# EAGLE design BrewDoo (EAGLE 7.2.0)
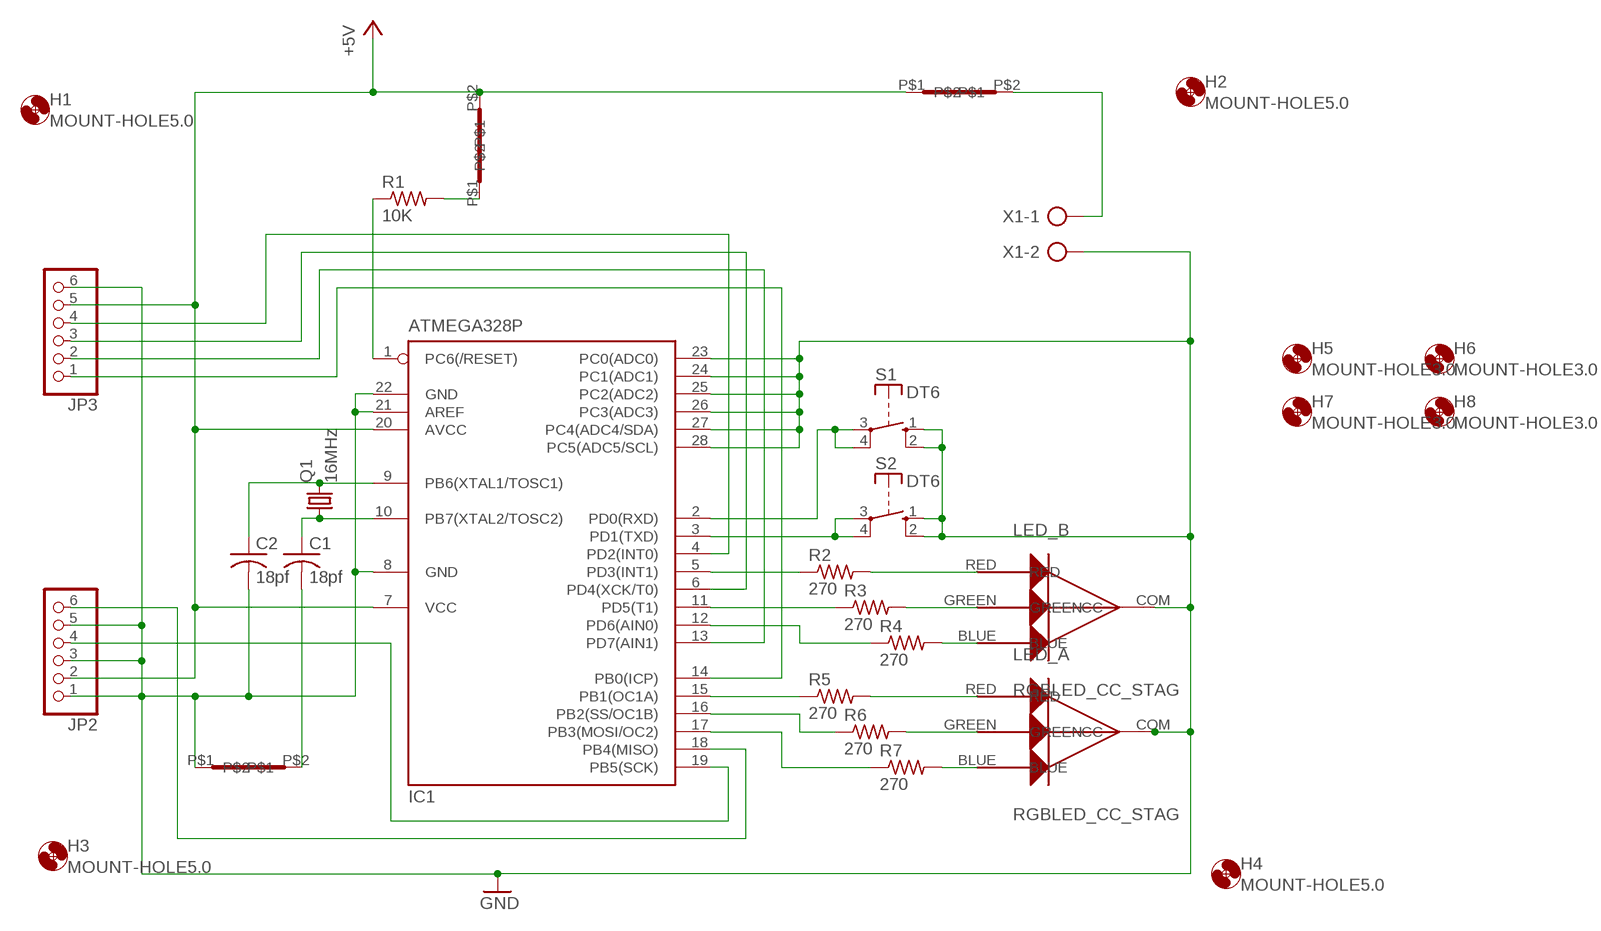
[diagram p0: schematic, sheet 1]

## Parts
C1  18pf  C-US025-025X050  [C025-025X050]
C2  18pf  C-US025-025X050  [C025-025X050]
H1  MOUNT-HOLE5.0  [5,0]
H2  MOUNT-HOLE5.0  [5,0]
H3  MOUNT-HOLE5.0  [5,0]
H4  MOUNT-HOLE5.0  [5,0]
H5  MOUNT-HOLE3.0  [3,0]
H6  MOUNT-HOLE3.0  [3,0]
H7  MOUNT-HOLE3.0  [3,0]
H8  MOUNT-HOLE3.0  [3,0]
IC1  ATMEGA328P  MEGA8-P  [DIL28-3]
JP2  PINHD-1X6  [1X06]
JP3  PINHD-1X6  [1X06]
LED_A  RGBLED_CC_STAG  [RGBLED_STAGG]
LED_B  RGBLED_CC_STAG  [RGBLED_STAGG]
Q1  16MHz  CRYSTALHC49S  [HC49/S]
R1  10K  R-US_0204/7  [0204/7]
R2  270  R-US_0207/12  [0207/12]
R3  270  R-US_0207/10  [0207/10]
R4  270  R-US_0207/10  [0207/10]
R5  270  R-US_0207/15  [0207/15]
R6  270  R-US_0207/15  [0207/15]
R7  270  R-US_0207/15  [0207/15]
S1  DT6  [DT6]
S2  DT6  [DT6]
U$1  WIRE-0.3  [WIRE-0.3]
U$2  WIRE-0.3  [WIRE-0.3]
U$3  WIRE-0.6  [WIRE-0.6]
X1  AK300/2  [AK300/2]

## Nets
+5V: IC1.7(VCC) IC1.20(AVCC) JP2.2 JP3.5 R1.2 U$1.P$1 U$1.P$2 U$3.P$1 U$3.P$2 X1.1
GND: C1.2 C2.2 IC1.8(GND) IC1.21(AREF) IC1.22(GND) IC1.23(PC0(ADC0)) IC1.24(PC1(ADC1)) IC1.25(PC2(ADC2)) IC1.26(PC3(ADC3)) IC1.27(PC4(ADC4/SDA)) IC1.28(PC5(ADC5/SCL)) JP2.1 JP2.3 JP2.5 JP3.6 LED_A.COM(CC) LED_B.COM(CC) S1.1(S) S1.2(S) S2.1(S) S2.2(S) U$2.P$1 U$2.P$2 X1.2
N$2: C2.1 IC1.9(PB6(XTAL1/TOSC1)) Q1.2
N$3: C1.1 IC1.10(PB7(XTAL2/TOSC2)) Q1.1
N$4: IC1.5(PD3(INT1)) R2.1
N$5: IC1.2(PD0(RXD)) S1.3(P) S1.4(P)
N$6: LED_B.RED R2.2
N$7: IC1.19(PB5(SCK)) JP2.4
N$8: IC1.18(PB4(MISO)) JP2.6
N$9: IC1.14(PB0(ICP)) JP3.1
N$10: IC1.13(PD7(AIN1)) JP3.2
N$11: IC1.6(PD4(XCK/T0)) JP3.3
N$12: IC1.4(PD2(INT0)) JP3.4
N$13: IC1.15(PB1(OC1A)) R5.1
N$14: LED_A.GREEN R6.2
N$15: IC1.17(PB3(MOSI/OC2)) R7.1
N$16: LED_B.GREEN R3.2
N$17: LED_B.BLUE R4.2
N$18: IC1.11(PD5(T1)) R3.1
N$19: IC1.3(PD1(TXD)) S2.3(P) S2.4(P)
N$20: IC1.12(PD6(AIN0)) R4.1
N$21: LED_A.RED R5.2
N$22: IC1.16(PB2(SS/OC1B)) R6.1
N$23: LED_A.BLUE R7.2
RESET: IC1.1(PC6(/RESET)) R1.1

## Library data of the parts
C1 C2 = rcl:C-US: CAPACITOR, American symbol
H1-H8 = holes:MOUNT-HOLE: MOUNTING HOLE with drill center marker
IC1 = atmel:MEGA8-P: MICROCONTROLLER 8 Kbytes FLASH, 1 kbytes SRAM, 512 bytes EEPROM, USART, 4-channel 10 bit ADC, 2-channel 8 bit ADC Pin compatible with Atmega48, ATMega88, ATMega168 Source: avr.lbr; OC_FARNELL: unknown; OC_NEWARK: unknown
JP2 JP3 = pinhead:PINHD-1X6: PIN HEADER
LED_A LED_B = LEDs-pk:RGBLED_CC_STAG
Q1 = crystal:CRYSTAL: CRYSTAL; OC_FARNELL: 1667008; OC_NEWARK: unknown
R1-R7 = rcl:R-US_: RESISTOR, American symbol
S1 S2 = switch-misc:DT: ITT SWITCH
U$1 U$2 = jumper-wires-pk:WIRE-0.3
U$3 = jumper-wires-pk:WIRE-0.6
X1 = con-ptr500:AK300/2: CONNECTOR; OC_FARNELL: unknown; OC_NEWARK: unknown

## Board
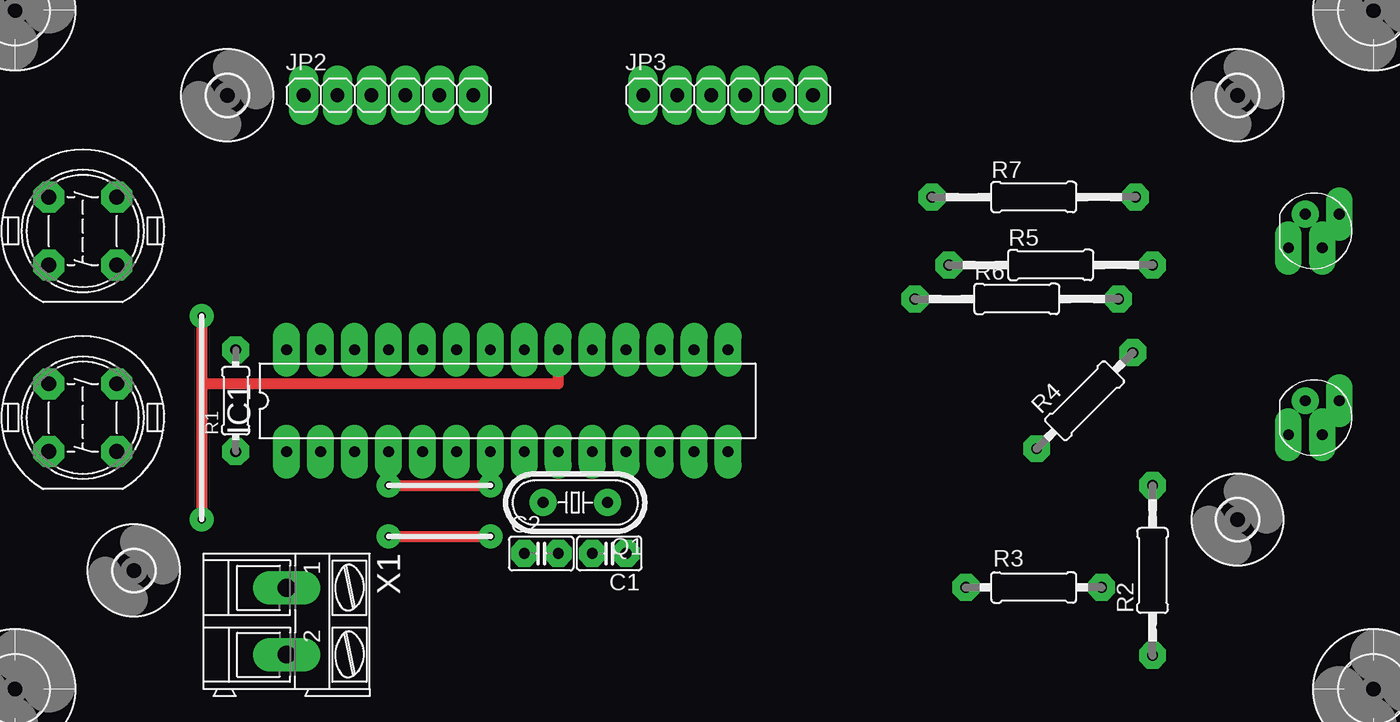
[diagram p1: board, top side]
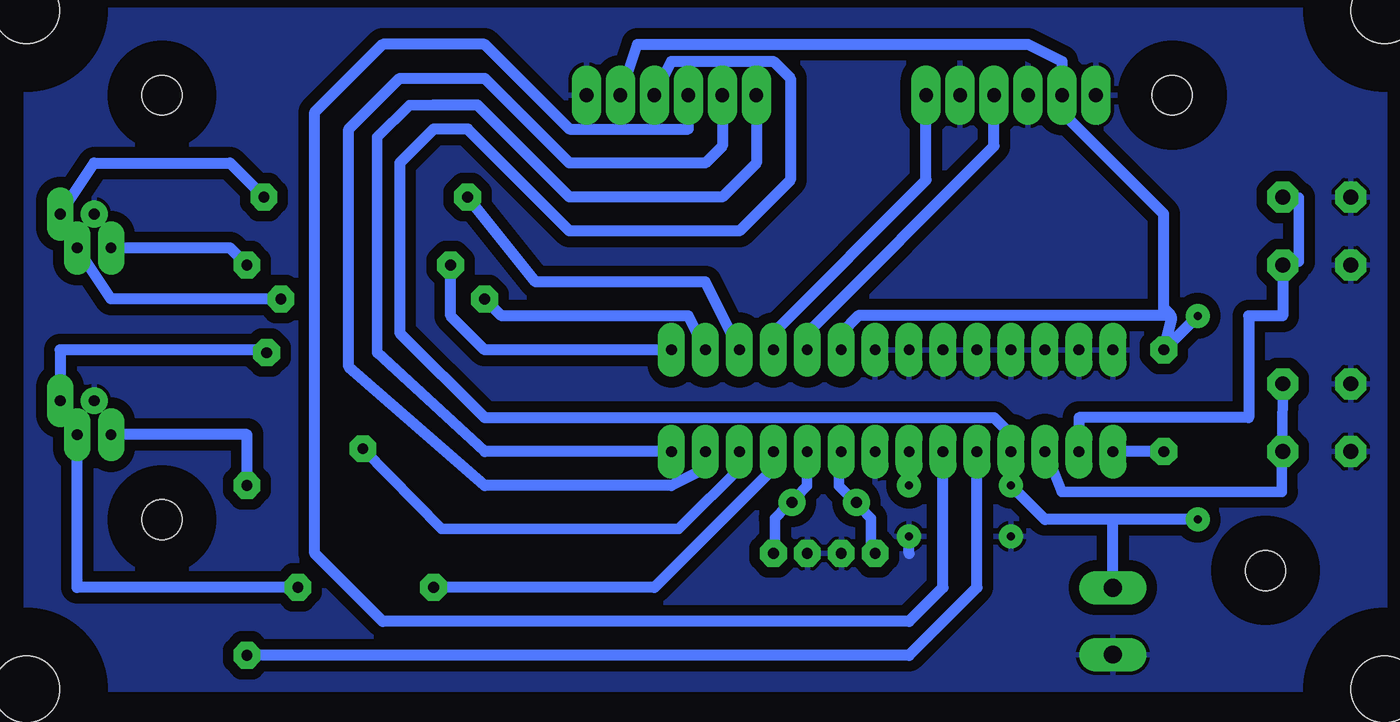
[diagram p2: board, bottom side, seen from below]

No outline drawn. Coordinates in mm, seen from the top.
Copper layers 1+16: Top 0.035mm / dielectric 1.5mm / Bottom 0.035mm
Design rules "hobby-layer16 *": minimum track width 0.8mm, minimum drill 0.8mm, track to track 0.8mm, track to pad 0.8mm, pad to pad 0.45mm, via to via 0.8mm, smd to smd 8mil, copper to edge 40mil, drill to drill 8mil, minimum pad ring 0.6mm, minimum via ring 0.6mm, stop-mask expansion 4mil, vias tented up to drill 0mil, thermal gap 10mil
vRestrict: area 14,11.4 to 94,48.3

### Footprints (pad centres in the part's own frame; a part is rotated, then mirrored left to right if it is on the bottom)
C025-025X050 = drill 0.813 octagon: 1 -1.27,0; 2 1.27,0
5,0 = hole 5: 0,0
3,0 = hole 3: 0,0
DIL28-3 = drill 0.813 long: 1 -16.51,-3.81; 2 -13.97,-3.81; 3 -11.43,-3.81; 4 -8.89,-3.81; 5 -6.35,-3.81; 6 -3.81,-3.81; 7 -1.27,-3.81; 8 1.27,-3.81; 9 3.81,-3.81; 10 6.35,-3.81; 11 8.89,-3.81; 12 11.43,-3.81; 13 13.97,-3.81; 14 16.51,-3.81; 15 16.51,3.81; 16 13.97,3.81; 17 11.43,3.81; 18 8.89,3.81; 19 6.35,3.81; 20 3.81,3.81; 21 1.27,3.81; 22 -1.27,3.81; 23 -3.81,3.81; 24 -6.35,3.81; 25 -8.89,3.81; 26 -11.43,3.81; 27 -13.97,3.81; 28 -16.51,3.81
1X06 = drill 1.016 long: 1 -6.35,0; 2 -3.81,0; 3 -1.27,0; 4 1.27,0; 5 3.81,0; 6 6.35,0
RGBLED_STAGG = drill 0.8 pad 1.27 long: BLUE 1.905,1.27; GREEN 0.635,-1.27; RED -1.905,-1.27 | drill 0.8 pad 1.676: COM -0.635,1.27
HC49/S = drill 0.813: 1 -2.413,0; 2 2.413,0
0204/7 = drill 0.813 octagon: 1 -3.81,0; 2 3.81,0
0207/12 = drill 0.813 octagon: 1 -6.35,0; 2 6.35,0
0207/10 = drill 0.813 octagon: 1 -5.08,0; 2 5.08,0
0207/15 = drill 0.813 octagon: 1 -7.62,0; 2 7.62,0
DT6 = drill 1.118 octagon: 1 -2.54,2.54; 2 2.54,2.54; 3 2.54,-2.54; 4 -2.54,-2.54
WIRE-0.3 = drill 0.6 pad 1.016: P$1 -3.81,0; P$2 3.81,0
WIRE-0.6 = drill 0.6 pad 1.016: P$1 -7.62,0; P$2 7.62,0
AK300/2 = drill 1.321 long: 1 -2.515,0; 2 2.489,0

### Placement (x,y rotation side)
C1  44.45,10.16 180 top
C2  39.37,10.16 0 top
H1  0,50.8 0 top
H2  0,0 0 top
H3  101.6,0 0 top
H4  101.6,50.8 0 top
H5  15.88,44.45 0 top
H6  91.44,44.45 0 top
H7  91.44,12.7 0 top
H8  8.89,8.89 0 top
IC1  36.83,21.59 0 top
JP2  27.94,44.45 0 top
JP3  53.34,44.45 0 top
LED_A  97.16,34.29 0 top
LED_B  97.16,20.32 0 top
Q1  41.91,13.97 180 top
R1  16.51,21.59 90 top
R2  85.09,8.89 90 top
R3  76.2,7.62 0 top
R4  80.01,21.59 45 top
R5  77.47,31.75 0 top
R6  74.93,29.21 0 top
R7  76.2,36.83 0 top
S1  5.08,34.29 90 top
S2  5.08,20.32 90 top
U$1  31.75,15.24 180 top
U$2  31.75,11.43 0 top
U$3  13.97,20.32 90 top
X1  20.32,5.08 270 top

### Tracks (layer width: path | path; a pad name or v marks a point on that pad's centre or on a via)
+5V
  Top 0.813: U$1.P$2 U$1.P$1 | IC1.20 40.64,22.86 13.97,22.86 | U$3.P$2 13.97,22.86 | 13.97,22.86 U$3.P$1
  Bottom 0.813: IC1.7 U$1.P$1 | U$3.P$2 R1.2 15.92,27.74 16,28 | U$1.P$2 25.4,12.7 20.32,12.7 | IC1.20 40.64,26.67 39.31,28 16,28 | 16,28 16.51,28.51 16.51,35.56 24.13,43.18 JP2.2 24.13,46.99 26.67,48.26 55.88,48.26 JP3.5 | X1.1 20.32,12.7 | U$3.P$1 20.32,12.7
GND
  Top 0.813: U$2.P$1 U$2.P$2
  Bottom 0.813: 35.56,10.16 U$2.P$2
  pour Bottom: 0,0 0,50.8 101.6,50.8 101.6,0
N$2
  Bottom 0.8: C2.1 38.4,10.87 38.4,12.8 39.2,13.6 Q1.2 40,14.4 40.8,15.2 40.8,17.6 IC1.9
N$3
  Bottom 0.8: C1.1 45.6,10.87 45.6,12.8 44.8,13.6 Q1.1 44,14.4 43.2,15.2 43.2,17.6 IC1.10
N$4
  Bottom 0.813: IC1.5 30.48,7.62 35.56,2.54 R2.1
N$5
  Bottom 0.8: S1.4 6.4,32 6.4,36.8 S1.3
  Bottom 0.813: S1.4 7.62,27.94 10.16,27.94 10.16,20.32 22.86,20.32 IC1.2
N$6
  Bottom 0.813: R2.2 85.09,19.05 LED_B.RED
N$7
  Bottom 0.813: IC1.19 43.18,26.67 29.21,40.64 JP2.4
N$8
  Bottom 0.813: IC1.18 45.72,26.67 34.29,38.1 JP2.6
N$9
  Bottom 0.8: 75.34,25.18 75.34,41.32 72.94,43.72 71.15,43.72
  Bottom 0.813: IC1.14 67.31,17.78 75.34,25.18 | JP3.1 46.99,39.37 49.53,36.83 60.96,36.83 67.85,43.72 71.15,43.72
N$10
  Bottom 0.813: IC1.13 50.8,16.51 53.34,15.24 67.31,15.24 77.47,24.13 77.47,41.91 73.66,45.72 67.31,45.72 60.96,39.37 50.8,39.37 49.53,40.64 JP3.2
N$11
  Bottom 0.813: IC1.6 33.02,7.62 35.56,5.08 74.93,5.08 80.01,10.16 80.01,43.18 74.93,48.26 67.31,48.26 60.96,41.91 52.07,41.91 JP3.3
N$12
  Bottom 0.813: JP3.4 53.34,46.99 45.72,46.99 44.45,45.72 44.45,38.1 48.26,34.29 60.96,34.29 68.58,41.91 71.12,41.91 73.66,39.37 73.66,26.67 67.31,20.32 29.21,20.32 27.94,19.05 IC1.4
N$13
  Bottom 0.813: IC1.15 67.31,25.4 69.85,27.94 R5.1
N$14
  Bottom 0.813: R6.2 95.25,29.21 LED_A.GREEN
N$15
  Bottom 0.813: IC1.17 50.8,30.48 63.5,30.48 R7.1
N$16
  Bottom 0.813: R3.2 97.79,7.62 LED_B.GREEN
N$17
  Bottom 0.813: R4.2 83.82,25.4 99.06,25.4 LED_B.BLUE
N$18
  Bottom 0.813: IC1.11 45.72,16.51 54.61,7.62 R3.1
N$19
  Bottom 0.8: 7.67,14.78 24.14,14.78 25.6,18.4 IC1.3 | 7.67,14.78 7.67,17.13 S2.4 | 7.67,14.78 S2.3
N$20
  Bottom 0.8: IC1.12 48,17.6 48,16.8 52.8,12 70.54,12 R4.1
N$21
  Bottom 0.813: R5.2 86.36,33.02 LED_A.RED
N$22
  Bottom 0.813: IC1.16 52.07,27.94 66.04,27.94 R6.1
N$23
  Bottom 0.813: LED_A.BLUE 96.52,39.37 86.36,39.37 R7.2
RESET
  Bottom 0.813: R1.1 IC1.1